# Altium schematic sheet HDMI.SchDoc
size A3; SheetNumber: 8; SheetTotal: 20
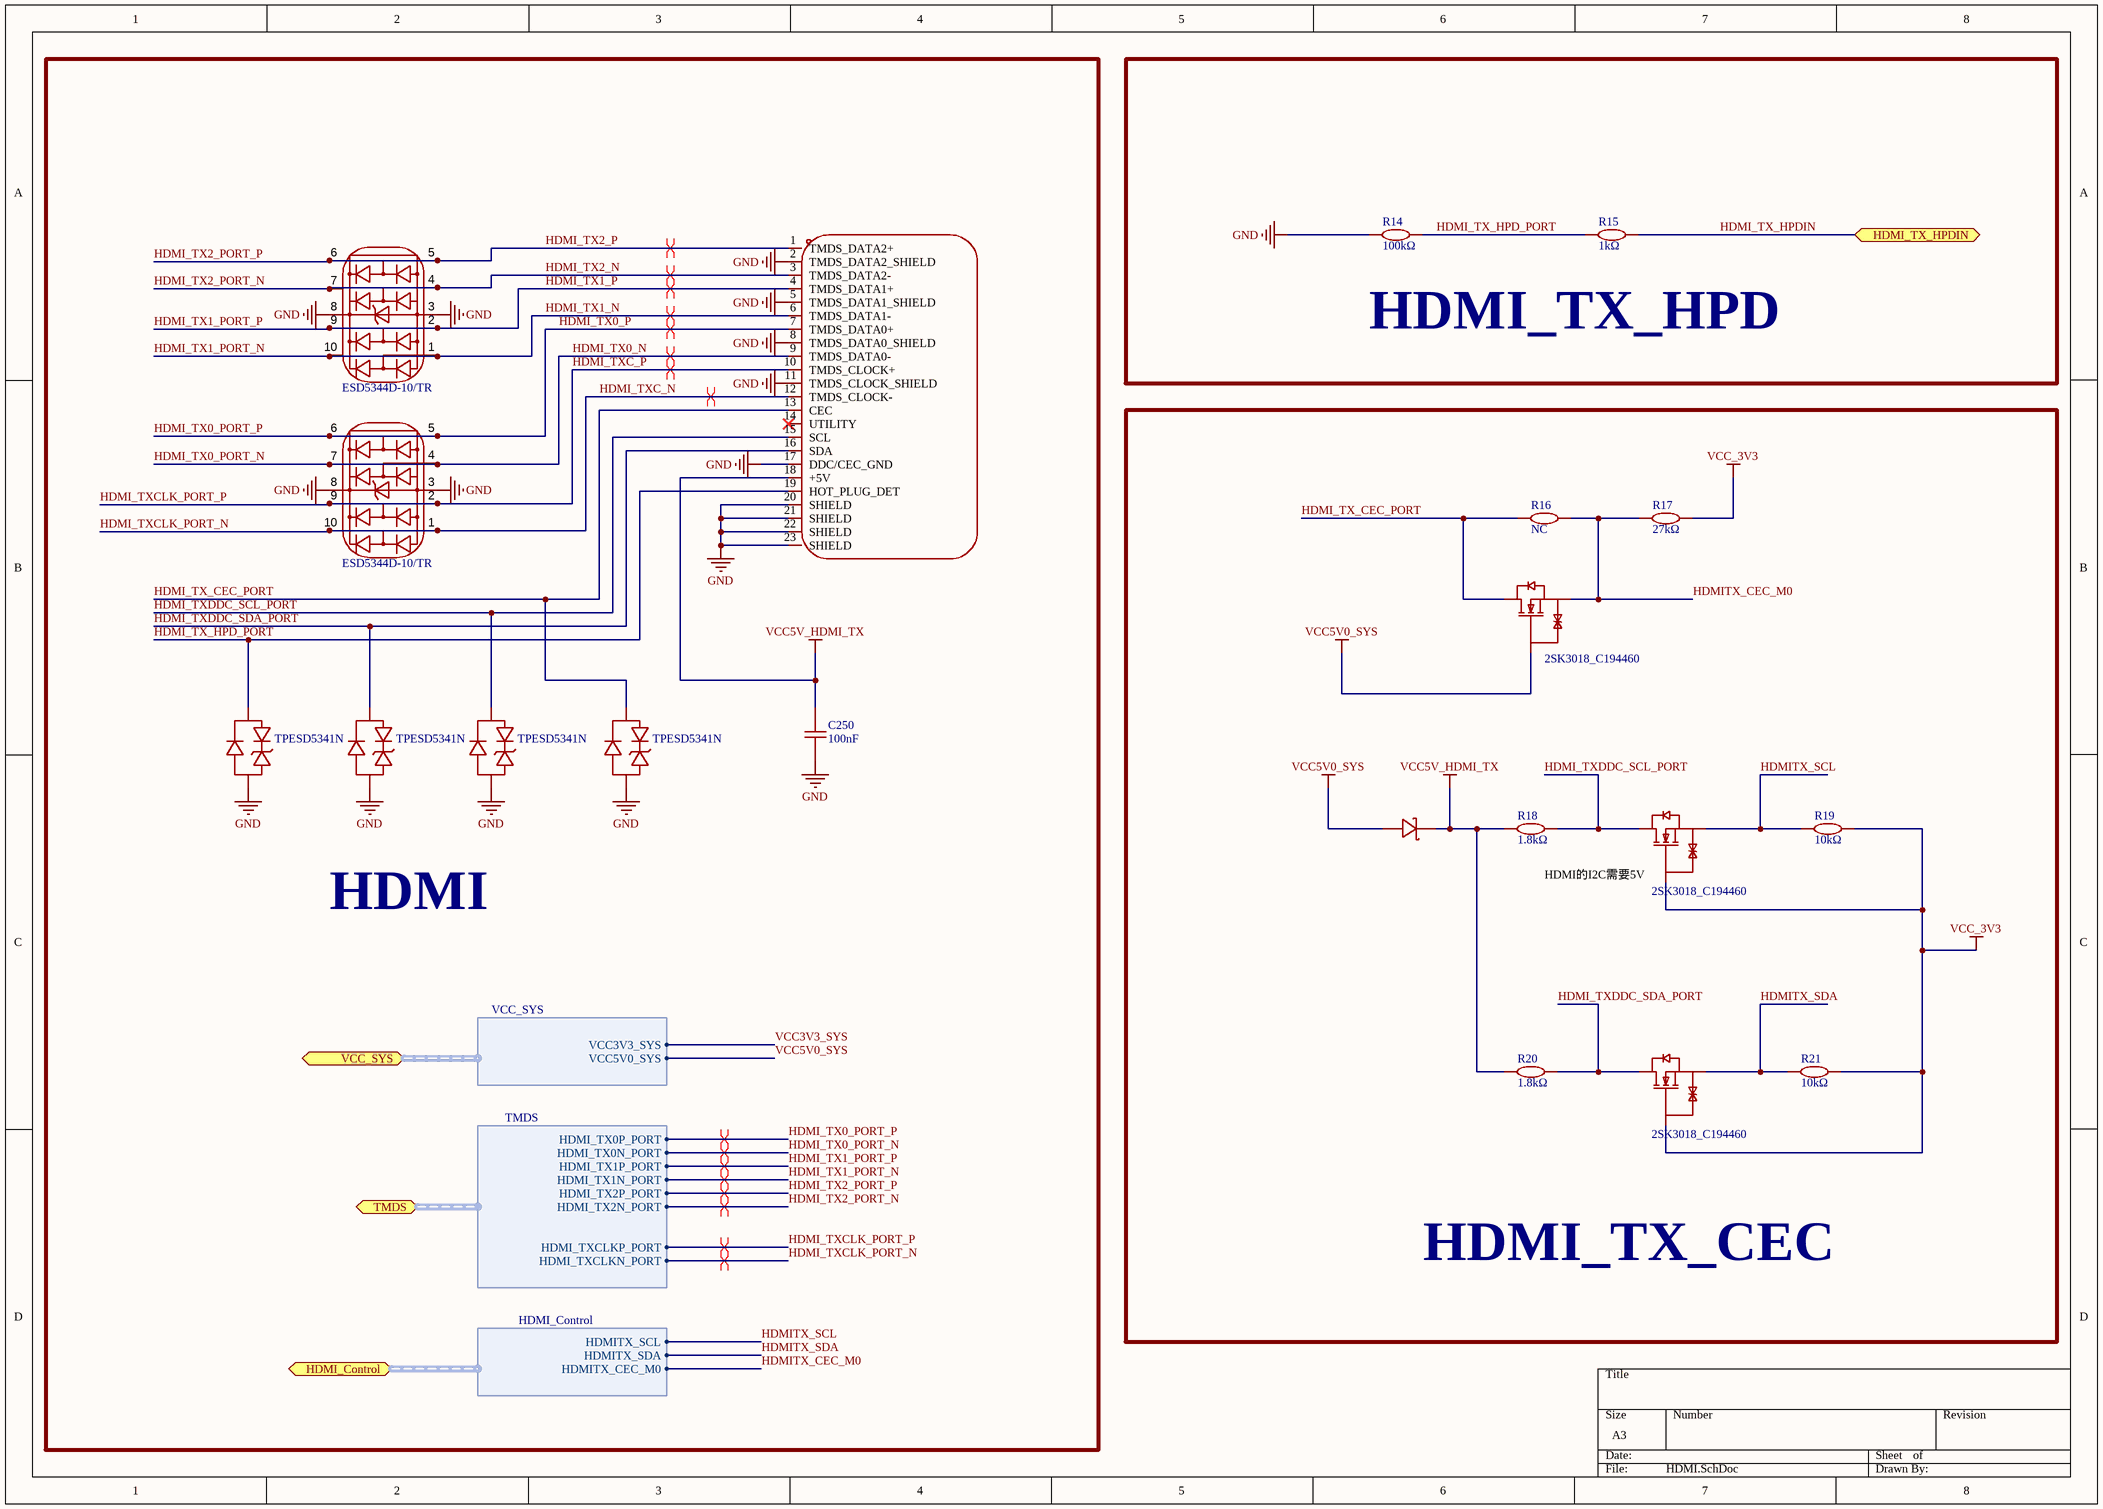
[diagram p0: HDMI.SchDoc]

## Parts
C250  100nF  [C0402]
CN1  KH-HDMI-19P-Cu  [HDMI-SMD_KH-HDMI-19P-CU]  (value not drawn)
D1  ESD5344D-10/TR  [DFN2510-10_L2.5-W1.0-P0.50-BL]
D2  ESD5344D-10/TR  [DFN2510-10_L2.5-W1.0-P0.50-BL]
D3  TPESD5341N  [X1-DFN1006-2_L1.0-W0.6-RD]
D4  TPESD5341N  [X1-DFN1006-2_L1.0-W0.6-RD]
D5  TPESD5341N  [X1-DFN1006-2_L1.0-W0.6-RD]
D6  TPESD5341N  [X1-DFN1006-2_L1.0-W0.6-RD]
D7  1N5819WS  [SOD-323_L1.8-W1.3-LS2.5-RD]  (value not drawn)
Q1  2SK3018_C194460  [SOT-23-3_L2.9-W1.3-P1.90-LS2.3-BR]
Q2  2SK3018_C194460  [SOT-23-3_L2.9-W1.3-P1.90-LS2.3-BR]
Q3  2SK3018_C194460  [SOT-23-3_L2.9-W1.3-P1.90-LS2.3-BR]
R14  100kΩ  [R0402]
R15  1kΩ  [R0402]
R16  NC  [R0402]
R17  27kΩ  [R0402]
R18  1.8kΩ  [R0402]
R19  10kΩ  [R0402]
R20  1.8kΩ  [R0402]
R21  10kΩ  [R0402]

## Blocks framed on the sheet
HDMI: C250 CN1 D1-D6
HDMI_TX_HPD: R14 R15
HDMI_TX_CEC: D7 Q1-Q3 R16-R21

## Ports
HDMI_Control (bidir, harness HDMI_Control, see Overview[6D], RK3566[3C], RK3566_USB_GPIO[5A]), HDMI_TX_HPDIN (bidir, see Overview[6D], RK3566[3A], RK3566_MIPI_HDMI[1C]), TMDS (bidir, harness TMDS, see Overview[6D], RK3566[3A], RK3566_MIPI_HDMI[2A]), VCC_SYS (bidir, harness VCC_SYS, see Overview[7D], Audio_AND_HPJ[3A], DEBUG_AND_GPIO[1D], MIPI_DSI_TP[6A], POWER[3B], POWER[6B], POWER_EXTENSION[4D], POWER_FLASH_POWER_MANAGE[3C], POWER_PMIC[6D], Wi-Fi_BT[3D])

## Harnesses
TMDS: HDMI_TX0P_PORT, HDMI_TX0N_PORT, HDMI_TX1P_PORT, HDMI_TX1N_PORT, HDMI_TX2P_PORT, HDMI_TX2N_PORT, HDMI_TXCLKP_PORT, HDMI_TXCLKN_PORT
HDMI_Control: HDMITX_SCL, HDMITX_SDA, HDMITX_CEC_M0
VCC_SYS: VCC3V3_SYS, VCC5V0_SYS

## Nets
GND: C250.1 CN1.2(TMDS_DATA2_SHIELD) CN1.5(TMDS_DATA1_SHIELD) CN1.8(TMDS_DATA0_SHIELD) CN1.11(TMDS_CLOCK_SHIELD) CN1.17(DDC/CEC_GND) CN1.20(SHIELD) CN1.21(SHIELD) CN1.22(SHIELD) CN1.23(SHIELD) D1.3 D1.8 D2.3 D2.8 D3.2 D4.2 D5.2 D6.2 R14.1
VCC5V0_SYS: D7.2(A) Q1.1(G) ; port VCC_SYS.VCC5V0_SYS
VCC5V_HDMI_TX: C250.2 CN1.18(+5V) D7.1(K) R18.1 R20.1
VCC_3V3: Q2.1(G) Q3.1(G) R17.2 R19.2 R21.2
HDMI_TX0_N: CN1.9(TMDS_DATA0-) D2.4 D2.7 ; port TMDS.HDMI_TX0N_PORT  [also labelled HDMI_TX0_PORT_N]
HDMI_TX0_P: CN1.7(TMDS_DATA0+) D2.5 D2.6 ; port TMDS.HDMI_TX0P_PORT  [also labelled HDMI_TX0_PORT_P]
HDMI_TX1_N: CN1.6(TMDS_DATA1-) D1.1 D1.10 ; port TMDS.HDMI_TX1N_PORT  [also labelled HDMI_TX1_PORT_N]
HDMI_TX1_P: CN1.4(TMDS_DATA1+) D1.2 D1.9 ; port TMDS.HDMI_TX1P_PORT  [also labelled HDMI_TX1_PORT_P]
HDMI_TX2_N: CN1.3(TMDS_DATA2-) D1.4 D1.7 ; port TMDS.HDMI_TX2N_PORT  [also labelled HDMI_TX2_PORT_N]
HDMI_TX2_P: CN1.1(TMDS_DATA2+) D1.5 D1.6 ; port TMDS.HDMI_TX2P_PORT  [also labelled HDMI_TX2_PORT_P]
HDMI_TX_CEC_PORT: CN1.13(CEC) D6.1 Q1.3(D) R16.1
HDMI_TX_HPD_PORT: CN1.19(HOT_PLUG_DET) D3.1 R14.2 R15.1
HDMI_TX_HPDIN: R15.2 ; port HDMI_TX_HPDIN
HDMI_TXC_N: CN1.12(TMDS_CLOCK-) D2.1 D2.10 ; port TMDS.HDMI_TXCLKN_PORT  [also labelled HDMI_TXCLK_PORT_N]
HDMI_TXC_P: CN1.10(TMDS_CLOCK+) D2.2 D2.9 ; port TMDS.HDMI_TXCLKP_PORT  [also labelled HDMI_TXCLK_PORT_P]
HDMI_TXDDC_SCL_PORT: CN1.15(SCL) D5.1 Q2.3(D) R18.2
HDMI_TXDDC_SDA_PORT: CN1.16(SDA) D4.1 Q3.3(D) R20.2
HDMITX_CEC_M0: Q1.2(S) R16.2 R17.1 ; port HDMI_Control.HDMITX_CEC_M0
HDMITX_SCL: Q2.2(S) R19.1 ; port HDMI_Control.HDMITX_SCL
HDMITX_SDA: Q3.2(S) R21.1 ; port HDMI_Control.HDMITX_SDA
VCC3V3_SYS: port VCC_SYS.VCC3V3_SYS

Not connected (* = marked no-connect by the designer): CN1 14(UTILITY)*

## Layout directives
differential pair: HDMI_TX0_N, HDMI_TX0_P, HDMI_TX1_N, HDMI_TX1_P, HDMI_TX2_N, HDMI_TX2_P, HDMI_TXC_N, HDMI_TXC_P

## Notes on the sheet
- (near Q2) HDMI的I2C需要5V

## Library data of the parts
C250 = 100nF: 50V 100nF X7R ±10% 0402 Ceramic Capacitors ROHS
CN1 = KH-HDMI-19P-Cu: HDMI-A SMD USB, DVI, HDMI Connector Assemblies ROHS; Manufacturer: kinghelm(金航标); Add into BOM: yes; Gender: Mother; Symbol: KH-HDMI-19P-CU; Device: KH-HDMI-19P-Cu; LCSC Part Name: KH-HDMI-19P-Cu; Supplier Part: C709361; Manufacturer Part: KH-HDMI-19P-Cu; Supplier Footprint: SMD; JLCPCB Part Class: Extended Part; Datasheet: https://atta.szlcsc.com/upload/public/pdf/source/20211208/D47DE7411E98B8CA58BDDFA754B04DEC.pdf; Supplier: LCSC; Convert to PCB: yes; Connector Type: HDMI-A; Number of Pins: 19P; Mounting Style: Horizontal attachment; Current Rating (Max): -; Rated Voltage (Max): -; Operating Temperature Range: -
D1 D2 = ESD5344D-10/TR: ESD5344D是一款超低电容TVS（瞬态电压抑制器）阵列，旨在保护高速数据接口。它专门用于保护连接到数据和传输线路的敏感电子元件，使其免受ESD（静电放电）引起的过应力影响。ESD5344D集成了四对超低电容转向二极管和一个TVS二极管。根据IEC61000 - 4 - 2标准，ESD5344D可提供高达±20kV（接触放电）的ESD保护；根据IEC61000 - 4 - 5标准，它能承受高达4A（8/20μs）的峰值脉冲电流。ESD5344D采用DFN2510 - 10L封装。标准产品无铅且无卤素。; Symbol: ESD5344D-10/TR
D3-D6 = TPESD5341N: VRWM:5V, IPP:3.3A, CJ:0.35pF; Symbol: TPESD5341N
D7 = 1N5819WS_C191023: 25A 40V 600mV@1A 1A SOD-323 Single Diodes ROHS; Manufacturer: Hottech(合科泰); Add into BOM: yes; Symbol: 1N5819WS; Device: 1N5819WS_C191023; LCSC Part Name: 电压:40V 电流:1A; Supplier Part: C191023; Manufacturer Part: 1N5819WS; Supplier Footprint: SOD-323; JLCPCB Part Class: Basic Part; Datasheet: https://item.szlcsc.com/datasheet/1N5819WS/213850.html; Supplier: LCSC; Convert to PCB: yes; Voltage - Forward(Vf@If): 600mV@1A; Voltage - DC Reverse(Vr): 40V; Current - Rectified: 1A; Non-Repetitive Peak Forward Surge Current: 25A
Q1-Q3 = 2SK3018_C194460: N沟道,30V,100mA; Symbol: 2SK3018_C194460
R14 = 100kΩ: 100kΩ 62.5mW 50V ±100ppm/℃ Thick Film Resistor ±1% 0402 Chip Resistor - Surface Mount ROHS
R15 = 1kΩ: 1kΩ 62.5mW 50V ±100ppm/℃ Thick Film Resistor ±1% 0402 Chip Resistor - Surface Mount ROHS
R16 = 0Ω: 0Ω 62.5mW 50V Thick Film Resistor ±1% 0402 Chip Resistor - Surface Mount ROHS
R17 = 27kΩ: 小尺寸、重量轻。降低组装成本,与贴片机匹配。适用于波峰焊和回流焊
R18 R20 = 1.8kΩ: 62.5mW 1.8kΩ 50V ±100ppm/℃ Thick Film Resistor ±1% 0402 Chip Resistor - Surface Mount ROHS
R19 R21 = 10kΩ: 62.5mW 10kΩ 50V ±100ppm/℃ Thick Film Resistor ±1% 0402 Chip Resistor - Surface Mount ROHS